# Altium project radxa_c200_io_board_v1.11.PrjPcb (part 8 of 8)

## Sheet 20_KEY_M_X2.SchDoc: C200
size 439 x 311 mm; Page Create Date: March  8, 1995; Page Number: 20; Page Size: Custom; Comment: radxa_1010; Page Count: 21; RevCode: V1.11; Doc: 20_KEY_M_X2; DsnPath: D:\WMS\C200\CC122\对外\C200 V1.11.DSN; SchematicName: c200; PageName: 20_KEY_M_X2; PageSize: Custom; TopSchematic: True
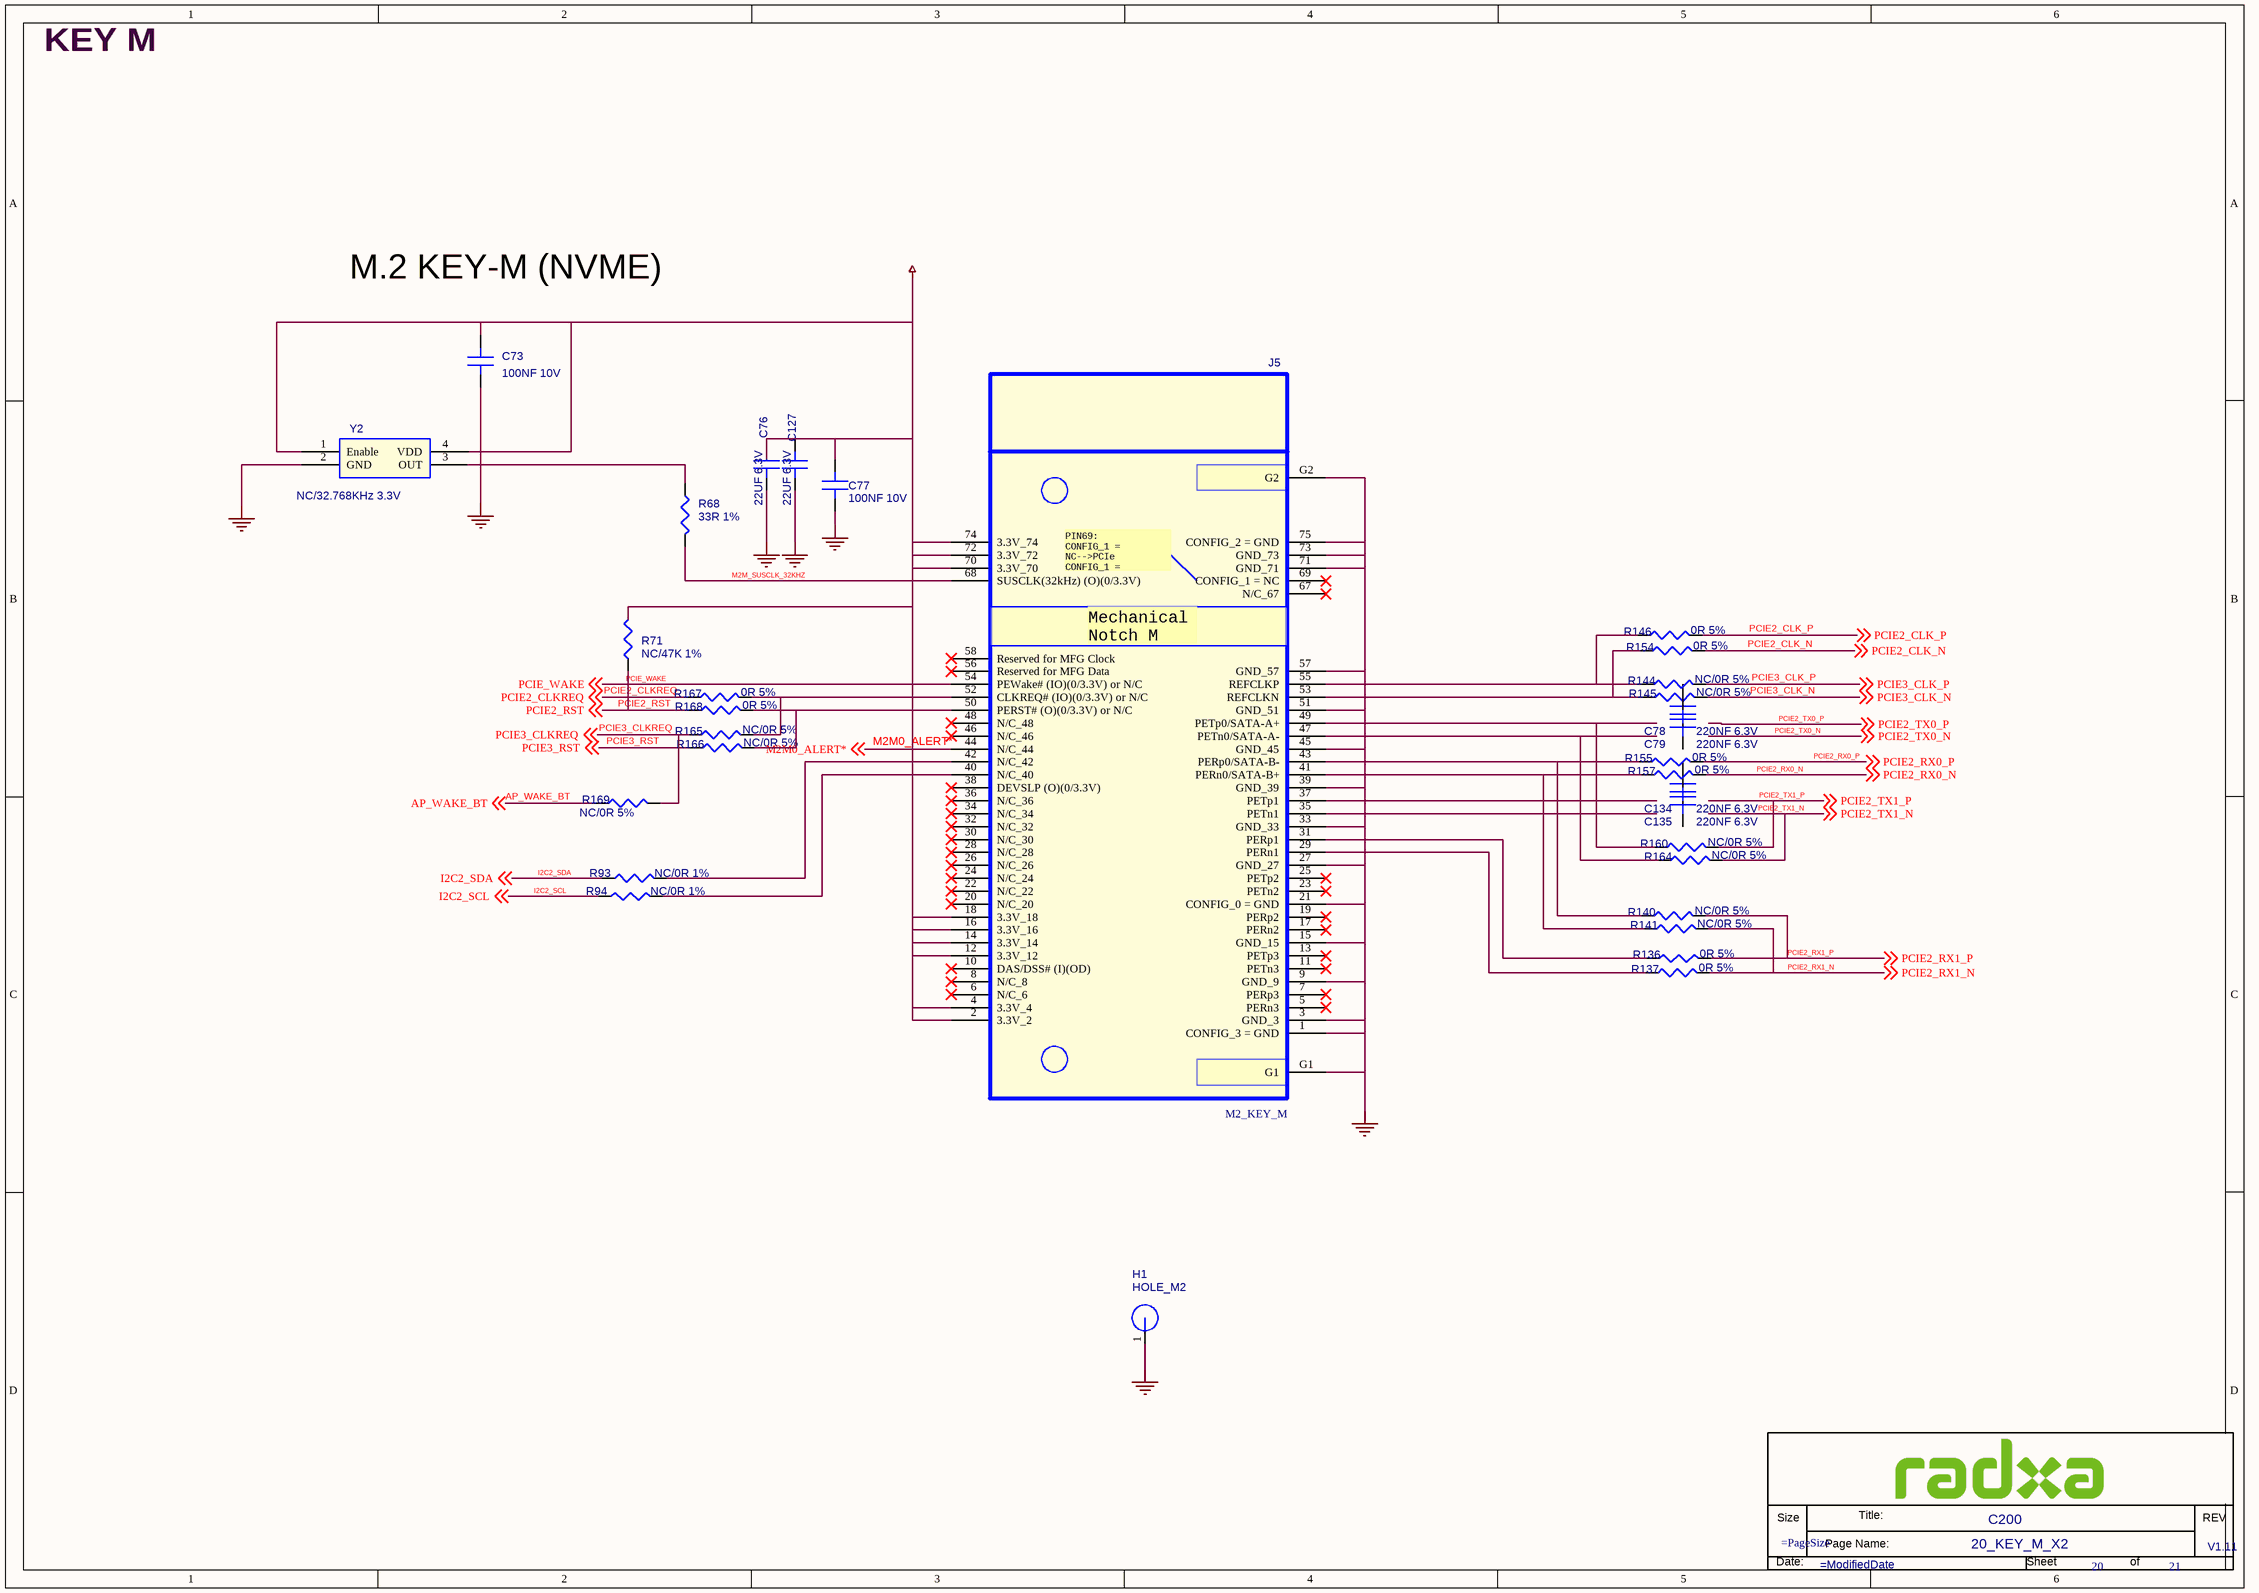
[diagram p39: 20_KEY_M_X2.SchDoc]

### Parts
(Parts that share a designator on the sheet are numbered #1, #2 ... from top to bottom, then left to right.)
*#19  Doc: 20_KEY_M_X2  RevCode: V1.11  Title: C200  Page Number: 20  Page Count: 21  (hidden comment: radxa_1010)  (graphical)
C73  100NF 10V  [C0402]
C76  22UF 6.3V  [C0603]
C77  100NF 10V  [C0402]
C78  220NF 6.3V  [C0201]
C79  220NF 6.3V  [C0201]
C127  22UF 6.3V  [C0603]
C134  220NF 6.3V  [C0201]
C135  220NF 6.3V  [C0201]
H1  HOLE_M2  [H3.8MM]
J5  M2_KEY_M  [M2-M_KEY_SM_75_0D5]
R68  33R 1%  [R0402]
R71  NC/47K 1%  [R0402]
R93  NC/0R 1%  [R0402]
R94  NC/0R 1%  [R0402]
R136  0R 5%  [R0402]
R137  0R 5%  [R0402]
R140  NC/0R 5%  [R0402]
R141  NC/0R 5%  [R0402]
R144  NC/0R 5%  [R0402]
R145  NC/0R 5%  [R0402]
R146  0R 5%  [R0402]
R154  0R 5%  [R0402]
R155  0R 5%  [R0402]
R157  0R 5%  [R0402]
R160  NC/0R 5%  [R0402]
R164  NC/0R 5%  [R0402]
R165  NC/0R 5%  [R0402]
R166  NC/0R 5%  [R0402]
R167  0R 5%  [R0402]
R168  0R 5%  [R0402]
R169  NC/0R 5%  [R0402]
Y2  NC/32.768KHz 3.3V  [Y-4-5_08-TXC-7W5]

### Nets
GND: C73.2(B) C76.2(B) C77.2(B) C127.2(B) H1.1 J5.1(CONFIG_3_=_GND) J5.3(GND_3) J5.9(GND_9) J5.15(GND_15) J5.21(CONFIG_0_=_GND) J5.27(GND_27) J5.33(GND_33) J5.39(GND_39) J5.45(GND_45) J5.51(GND_51) J5.57(GND_57) J5.71(GND_71) J5.73(GND_73) J5.75(CONFIG_2_=_GND) J5.G1 J5.G2 Y2.2(GND)  [project net HUB2_SSTX_N_J25]
MKEY_3V3: C73.1(A) C76.1(A) C77.1(A) C127.1(A) J5.2(3.3V_2) J5.4(3.3V_4) J5.12(3.3V_12) J5.14(3.3V_14) J5.16(3.3V_16) J5.18(3.3V_18) J5.70(3.3V_70) J5.72(3.3V_72) J5.74(3.3V_74) R71.1 Y2.1(Enable) Y2.4(VDD)
AP_WAKE_BT: R169.1 ; off-sheet AP_WAKE_BT
I2C2_SCL: R94.1 ; off-sheet I2C2_SCL
I2C2_SDA: R93.1 ; off-sheet I2C2_SDA
M2M0_ALERT*: J5.44(N/C_44) ; off-sheet M2M0_ALERT*
M2M_SUSCLK_32KHZ: J5.68(SUSCLK(32kHz)_(O)(0/3.3V)) R68.2
PCIE2_CLK_N: R154.2 ; off-sheet PCIE2_CLK_N
PCIE2_CLK_P: R146.2 ; off-sheet PCIE2_CLK_P
PCIE2_CLKREQ: R167.1 ; off-sheet PCIE2_CLKREQ
PCIE2_RST: R71.2 R168.1 ; off-sheet PCIE2_RST
PCIE2_RX0_N: R157.2 ; off-sheet PCIE2_RX0_N
PCIE2_RX0_P: R155.2 ; off-sheet PCIE2_RX0_P
PCIE2_RX1_N: R137.2 R141.2 ; off-sheet PCIE2_RX1_N
PCIE2_RX1_P: R136.2 R140.2 ; off-sheet PCIE2_RX1_P
PCIE2_TX1_N: R164.2 ; off-sheet PCIE2_TX1_N
PCIE2_TX1_P: R160.2 ; off-sheet PCIE2_TX1_P
PCIE3_CLK_N: R145.2 ; off-sheet PCIE3_CLK_N
PCIE3_CLK_P: R144.2 ; off-sheet PCIE3_CLK_P
PCIE3_CLKREQ: R165.1 R169.2 ; off-sheet PCIE3_CLKREQ
PCIE3_RST: R166.1 ; off-sheet PCIE3_RST
PCIE_WAKE: J5.54(PEWake#_(IO)(0/3.3V)_or_N/C) ; off-sheet PCIE_WAKE
NetJ5_29: J5.29(PERn1) R137.1
NetJ5_31: J5.31(PERp1) R136.1
NetJ5_40: J5.40(N/C_40) R94.2
NetJ5_41: J5.41(PERn0/SATA-B+) R141.1 R157.1
NetJ5_42: J5.42(N/C_42) R93.2
NetJ5_43: J5.43(PERp0/SATA-B-) R140.1 R155.1
NetJ5_47: J5.47(PETn0/SATA-A-) R164.1
NetJ5_49: J5.49(PETp0/SATA-A+) R160.1
NetJ5_50: J5.50(PERST#_(O)(0/3.3V)_or_N/C) R166.2 R168.2
NetJ5_52: J5.52(CLKREQ#_(IO)(0/3.3V)_or_N/C) R165.2 R167.2
NetJ5_53: J5.53(REFCLKN) R145.1 R154.1
NetJ5_55: J5.55(REFCLKP) R144.1 R146.1
NetR68_1: R68.1 Y2.3(OUT)

Not connected (* = marked no-connect by the designer): C78 1(A) 2(B); C79 1(A) 2(B); C134 1(A) 2(B); C135 1(A) 2(B); J5 5(PERn3)* 6(N/C_6)* 7(PERp3)* 8(N/C_8)* 10(DAS/DSS#_(I)(OD))* 11(PETn3)* 13(PETp3)* 17(PERn2)* 19(PERp2)* 20(N/C_20)* 22(N/C_22)* 23(PETn2)* 24(N/C_24)* 25(PETp2)* 26(N/C_26)* 28(N/C_28)* 30(N/C_30)* 32(N/C_32)* 34(N/C_34)* 35(PETn1) 36(N/C_36)* 37(PETp1) 38(DEVSLP_(O)(0/3.3V))* 46(N/C_46)* 48(N/C_48)* 56(Reserved_for_MFG_Data)* 58(Reserved_for_MFG_Clock)* 67(N/C_67)* 69(CONFIG_1_=_NC)*

### Notes on the sheet
- KEY M
- M.2 KEY-M (NVME)
- (in symbol M2_KEY_M) PIN69: / CONFIG_1 = NC-->PCIe / CONFIG_1 = / GND-->SATA; Mechanical / Notch M
- (in symbol radxa_1010) Size; Title:; REV; Page Name:; Date:; Sheet; of

### Library data of the parts
C73 = C: SMD  0402  100NF  10V  X5R  ±10%  ROHS; PARTS: 1; Part Reference: C73; Part Number: A1C01.00163; OriginalSymbolOrigin: (0,30); PKG_TYPE: CAP2-100-250; LEVEL: STD; PINSWAP: (A,B); Value: 100NF 10V; Part Type: 陶瓷电容; PCB Footprint: C0402
C76 = C: SMD  0603  22UF  6.3V  X5R  ±20%  ROHS; PARTS: 1; Part Reference: C76; Part Number: A1C01.00004; OriginalSymbolOrigin: (0,30); PKG_TYPE: CAP2-100-250; LEVEL: STD; PINSWAP: (A,B); Value: 22UF 6.3V; Part Type: 陶瓷电容; PCB Footprint: C0603
C77 = C: SMD  0402  100NF  10V  X5R  ±10%  ROHS; PARTS: 1; Part Reference: C77; Part Number: A1C01.00163; OriginalSymbolOrigin: (0,30); PKG_TYPE: CAP2-100-250; LEVEL: STD; PINSWAP: (A,B); Value: 100NF 10V; Part Type: 陶瓷电容; PCB Footprint: C0402
C78 = C: SMD  0201  220NF  6.3V  X5R  ±20%  ROHS; PARTS: 1; Part Reference: C78; CDS_PART_NAME: C_0402-0.22UF,X5R,10%,6.3V,039-0011-000; CDS_PHYS_PART_NAME: C_0402-0.22UF,X5R,10%,6.3V,039-0011-000-0.22UF,039-0011-000; Part Number: A1C01.00128; OriginalSymbolOrigin: (0,30); PKG_TYPE: CAP2-100-250; LEVEL: STD; PINSWAP: (A,B); ASSEMBLY: M2_NVME; CDS_LIB: discrete; DEVICE_TYPENAME: C_0402-022UFX5R1063V039-0011-000-022UF039-0011-000; DRAWING: #NAME?; NV_PN: 039-0011-000; PACK_TYPE: 402; PATH: I24; PHYS_PAGE: 21; ROT: 0; SIGNAL_MODEL: nv_cap; TOL: 10%; VER: 2; XY: (-3150,4300); Value: 220NF 6.3V; CDS_SEC: 1; CHIPS_PART_NAME: C; MAT: X5R; MAX_VOLTAGE: 6.3V; SEC: 1; Part Type: 陶瓷电容; PCB Footprint: C0201
C79 = C: SMD  0201  220NF  6.3V  X5R  ±20%  ROHS; PARTS: 1; Part Reference: C79; CDS_PART_NAME: C_0402-0.22UF,X5R,10%,6.3V,039-0011-000; CDS_PHYS_PART_NAME: C_0402-0.22UF,X5R,10%,6.3V,039-0011-000-0.22UF,039-0011-000; Part Number: A1C01.00128; OriginalSymbolOrigin: (0,30); PKG_TYPE: CAP2-100-250; LEVEL: STD; PINSWAP: (A,B); ASSEMBLY: M2_NVME; CDS_LIB: discrete; DEVICE_TYPENAME: C_0402-022UFX5R1063V039-0011-000-022UF039-0011-000; DRAWING: #NAME?; NV_PN: 039-0011-000; PACK_TYPE: 402; PATH: I8; PHYS_PAGE: 21; ROT: 0; SIGNAL_MODEL: nv_cap; TOL: 10%; VER: 2; XY: (-2700,4250); Value: 220NF 6.3V; CDS_SEC: 1; CHIPS_PART_NAME: C; MAT: X5R; MAX_VOLTAGE: 6.3V; SEC: 1; Part Type: 陶瓷电容; PCB Footprint: C0201
C127 = C: SMD  0603  22UF  6.3V  X5R  ±20%  ROHS; PARTS: 1; Part Reference: C127; Part Number: A1C01.00004; OriginalSymbolOrigin: (0,30); PKG_TYPE: CAP2-100-250; LEVEL: STD; PINSWAP: (A,B); Value: 22UF 6.3V; Part Type: 陶瓷电容; PCB Footprint: C0603
C134 = C: SMD  0201  220NF  6.3V  X5R  ±20%  ROHS; PARTS: 1; Part Reference: C134; CDS_PART_NAME: C_0402-0.22UF,X5R,10%,6.3V,039-0011-000; CDS_PHYS_PART_NAME: C_0402-0.22UF,X5R,10%,6.3V,039-0011-000-0.22UF,039-0011-000; Part Number: A1C01.00128; OriginalSymbolOrigin: (0,30); PKG_TYPE: CAP2-100-250; LEVEL: STD; PINSWAP: (A,B); ASSEMBLY: M2_NVME; CDS_LIB: discrete; DEVICE_TYPENAME: C_0402-022UFX5R1063V039-0011-000-022UF039-0011-000; DRAWING: #NAME?; NV_PN: 039-0011-000; PACK_TYPE: 402; PATH: I32; PHYS_PAGE: 21; ROT: 0; SIGNAL_MODEL: nv_cap; TOL: 10%; VER: 2; XY: (-3150,4000); Value: 220NF 6.3V; CDS_SEC: 1; CHIPS_PART_NAME: C; MAT: X5R; MAX_VOLTAGE: 6.3V; SEC: 1; Part Type: 陶瓷电容; PCB Footprint: C0201
C135 = C: SMD  0201  220NF  6.3V  X5R  ±20%  ROHS; PARTS: 1; Part Reference: C135; CDS_PART_NAME: C_0402-0.22UF,X5R,10%,6.3V,039-0011-000; CDS_PHYS_PART_NAME: C_0402-0.22UF,X5R,10%,6.3V,039-0011-000-0.22UF,039-0011-000; Part Number: A1C01.00128; OriginalSymbolOrigin: (0,30); PKG_TYPE: CAP2-100-250; LEVEL: STD; PINSWAP: (A,B); ASSEMBLY: M2_NVME; CDS_LIB: discrete; DEVICE_TYPENAME: C_0402-022UFX5R1063V039-0011-000-022UF039-0011-000; DRAWING: #NAME?; NV_PN: 039-0011-000; PACK_TYPE: 402; PATH: I21; PHYS_PAGE: 21; ROT: 0; SIGNAL_MODEL: nv_cap; TOL: 10%; VER: 2; XY: (-2700,3950); Value: 220NF 6.3V; CDS_SEC: 1; CHIPS_PART_NAME: C; MAT: X5R; MAX_VOLTAGE: 6.3V; SEC: 1; Part Type: 陶瓷电容; PCB Footprint: C0201
H1 = HOLE: Part Reference: H1; PCB Footprint: HOLE_2D7_6D0_A; RK PN: HOLE_3R50; Priority: A; Value: HOLE_M2; Part Type: HOLE
J5 = M2_KEY_M: SMD  母座  75PIN  180度  M.2  M KEY  H4.2  0.5mm脚距  APC10359-P001A  黑色  LOTES  ROHS; Part Reference: J5; Part Number: A1J01.00017; Parameter: 连接器-比派-封装 M2_KEY_M; Value: M2_KEY_M; Part Type: 连接座; PCB Footprint: M2-M_KEY_SM_75_0D5
R68 = R: SMD  0201  33R  1/20W  ±1%  ROHS; Part Reference: R68; Part Number: A1R01.00137; PCB Footprint: R0201; Value: 33R 1%; Part Type: 贴片电阻
R71 = R: SMD  0402  47K  1/16W  ±1%  ROHS; Part Reference: R71; Part Number: A1R01.00248; CDS_PART_NAME: R_0402-47K,5 %,62.5MW,195-0599-000; CDS_PHYS_PART_NAME: R_0402-47K,5 %,62.5MW,195-0599-000-195-0599-000,47K; ASSEMBLY: M2_NVME; CDS_LIB: discrete; CDS_SEC: 1; DEVICE_TYPENAME: R_0402-47K5625MW195-0599-000-195-0599-00047K; DRAWING: #NAME?; MAX_WATTAGE: 62.5mW; NV_PN: 195-0599-000; PACK_TYPE: 402; PATH: I39; PHYS_PAGE: 21; ROT: 2; SIGNAL_MODEL: nv_res; TOL: 5%; XY: (-8000,4600); PCB Footprint: R0402; Value: NC/47K 1%; Part Type: 贴片电阻; CHIPS_PART_NAME: R; SKU: NO STUFF; VER: 2; SEC: 1
R93 = R: SMD  0402  0R  1/16W  ±1%  ROHS; Part Reference: R93; Part Number: A1R01.00219; PCB Footprint: R0402; Value: NC/0R 1%; Part Type: 贴片电阻
R94 = R: SMD  0402  0R  1/16W  ±1%  ROHS; Part Reference: R94; Part Number: A1R01.00219; PCB Footprint: R0402; Value: NC/0R 1%; Part Type: 贴片电阻
R136 = R: SMD  0201  0R  1/20W  ±5%  ROHS; Part Reference: R136; Part Number: A1R01.00027; PCB Footprint: R0201; Temp Coeff: －55℃ ~ ＋125℃; Value: 0R 5%; Part Type: 贴片电阻
R137 = R: SMD  0201  0R  1/20W  ±5%  ROHS; Part Reference: R137; Part Number: A1R01.00027; PCB Footprint: R0201; Temp Coeff: －55℃ ~ ＋125℃; Value: 0R 5%; Part Type: 贴片电阻
R140 = R: SMD  0201  0R  1/20W  ±5%  ROHS; Part Reference: R140; Part Number: A1R01.00027; PCB Footprint: R0201; Temp Coeff: －55℃ ~ ＋125℃; Value: NC/0R 5%; Part Type: 贴片电阻
R141 = R: SMD  0201  0R  1/20W  ±5%  ROHS; Part Reference: R141; Part Number: A1R01.00027; PCB Footprint: R0201; Temp Coeff: －55℃ ~ ＋125℃; Value: NC/0R 5%; Part Type: 贴片电阻
R144 = R: SMD  0201  0R  1/20W  ±5%  ROHS; Part Reference: R144; Part Number: A1R01.00027; PCB Footprint: R0201; Temp Coeff: －55℃ ~ ＋125℃; Value: NC/0R 5%; Part Type: 贴片电阻
R145 = R: SMD  0201  0R  1/20W  ±5%  ROHS; Part Reference: R145; Part Number: A1R01.00027; PCB Footprint: R0201; Temp Coeff: －55℃ ~ ＋125℃; Value: NC/0R 5%; Part Type: 贴片电阻
R146 = R: SMD  0201  0R  1/20W  ±5%  ROHS; Part Reference: R146; Part Number: A1R01.00027; PCB Footprint: R0201; Temp Coeff: －55℃ ~ ＋125℃; Value: 0R 5%; Part Type: 贴片电阻
R154 = R: SMD  0201  0R  1/20W  ±5%  ROHS; Part Reference: R154; Part Number: A1R01.00027; PCB Footprint: R0201; Temp Coeff: －55℃ ~ ＋125℃; Value: 0R 5%; Part Type: 贴片电阻
R155 = R: SMD  0201  0R  1/20W  ±5%  ROHS; Part Reference: R155; Part Number: A1R01.00027; PCB Footprint: R0201; Temp Coeff: －55℃ ~ ＋125℃; Value: 0R 5%; Part Type: 贴片电阻
R157 = R: SMD  0201  0R  1/20W  ±5%  ROHS; Part Reference: R157; Part Number: A1R01.00027; PCB Footprint: R0201; Temp Coeff: －55℃ ~ ＋125℃; Value: 0R 5%; Part Type: 贴片电阻
R160 = R: SMD  0201  0R  1/20W  ±5%  ROHS; Part Reference: R160; Part Number: A1R01.00027; PCB Footprint: R0201; Temp Coeff: －55℃ ~ ＋125℃; Value: NC/0R 5%; Part Type: 贴片电阻
R164 = R: SMD  0201  0R  1/20W  ±5%  ROHS; Part Reference: R164; Part Number: A1R01.00027; PCB Footprint: R0201; Temp Coeff: －55℃ ~ ＋125℃; Value: NC/0R 5%; Part Type: 贴片电阻
R165 = R: SMD  0201  0R  1/20W  ±5%  ROHS; Part Reference: R165; Part Number: A1R01.00027; PCB Footprint: R0201; Temp Coeff: －55℃ ~ ＋125℃; Value: NC/0R 5%; Part Type: 贴片电阻
R166 = R: SMD  0201  0R  1/20W  ±5%  ROHS; Part Reference: R166; Part Number: A1R01.00027; PCB Footprint: R0201; Temp Coeff: －55℃ ~ ＋125℃; Value: NC/0R 5%; Part Type: 贴片电阻
R167 = R: SMD  0201  0R  1/20W  ±5%  ROHS; Part Reference: R167; Part Number: A1R01.00027; PCB Footprint: R0201; Temp Coeff: －55℃ ~ ＋125℃; Value: 0R 5%; Part Type: 贴片电阻
R168 = R: SMD  0201  0R  1/20W  ±5%  ROHS; Part Reference: R168; Part Number: A1R01.00027; PCB Footprint: R0201; Temp Coeff: －55℃ ~ ＋125℃; Value: 0R 5%; Part Type: 贴片电阻
R169 = R: SMD  0201  0R  1/20W  ±5%  ROHS; Part Reference: R169; Part Number: A1R01.00027; PCB Footprint: R0201; Temp Coeff: －55℃ ~ ＋125℃; Value: NC/0R 5%; Part Type: 贴片电阻
Y2 = OSC_4P_V: SMD  编带  有源  3225  32.768KHz  3.3V  ±10ppm  ROHS; Part Reference: Y2; Part Number: A1Y01.00030; PCB Footprint: OSC_SM4_3D2X2D5; Value: NC/32.768KHz 3.3V; Part Type: 晶振
*#19 = radxa_1010: Page Create Date: March  8, 1995; Page Size: =PageSize; Page Modify Date: =ModifiedDate

## Sheet 21_KEY_E.SchDoc: C200
size 439 x 311 mm; Page Create Date: March  8, 1995; Page Number: 21; Page Size: Custom; Comment: radxa_1010; Page Count: 21; RevCode: V1.11; Doc: 21_KEY_E; DsnPath: D:\WMS\C200\CC122\对外\C200 V1.11.DSN; SchematicName: c200; PageName: 21_KEY_E; PageSize: Custom; TopSchematic: True
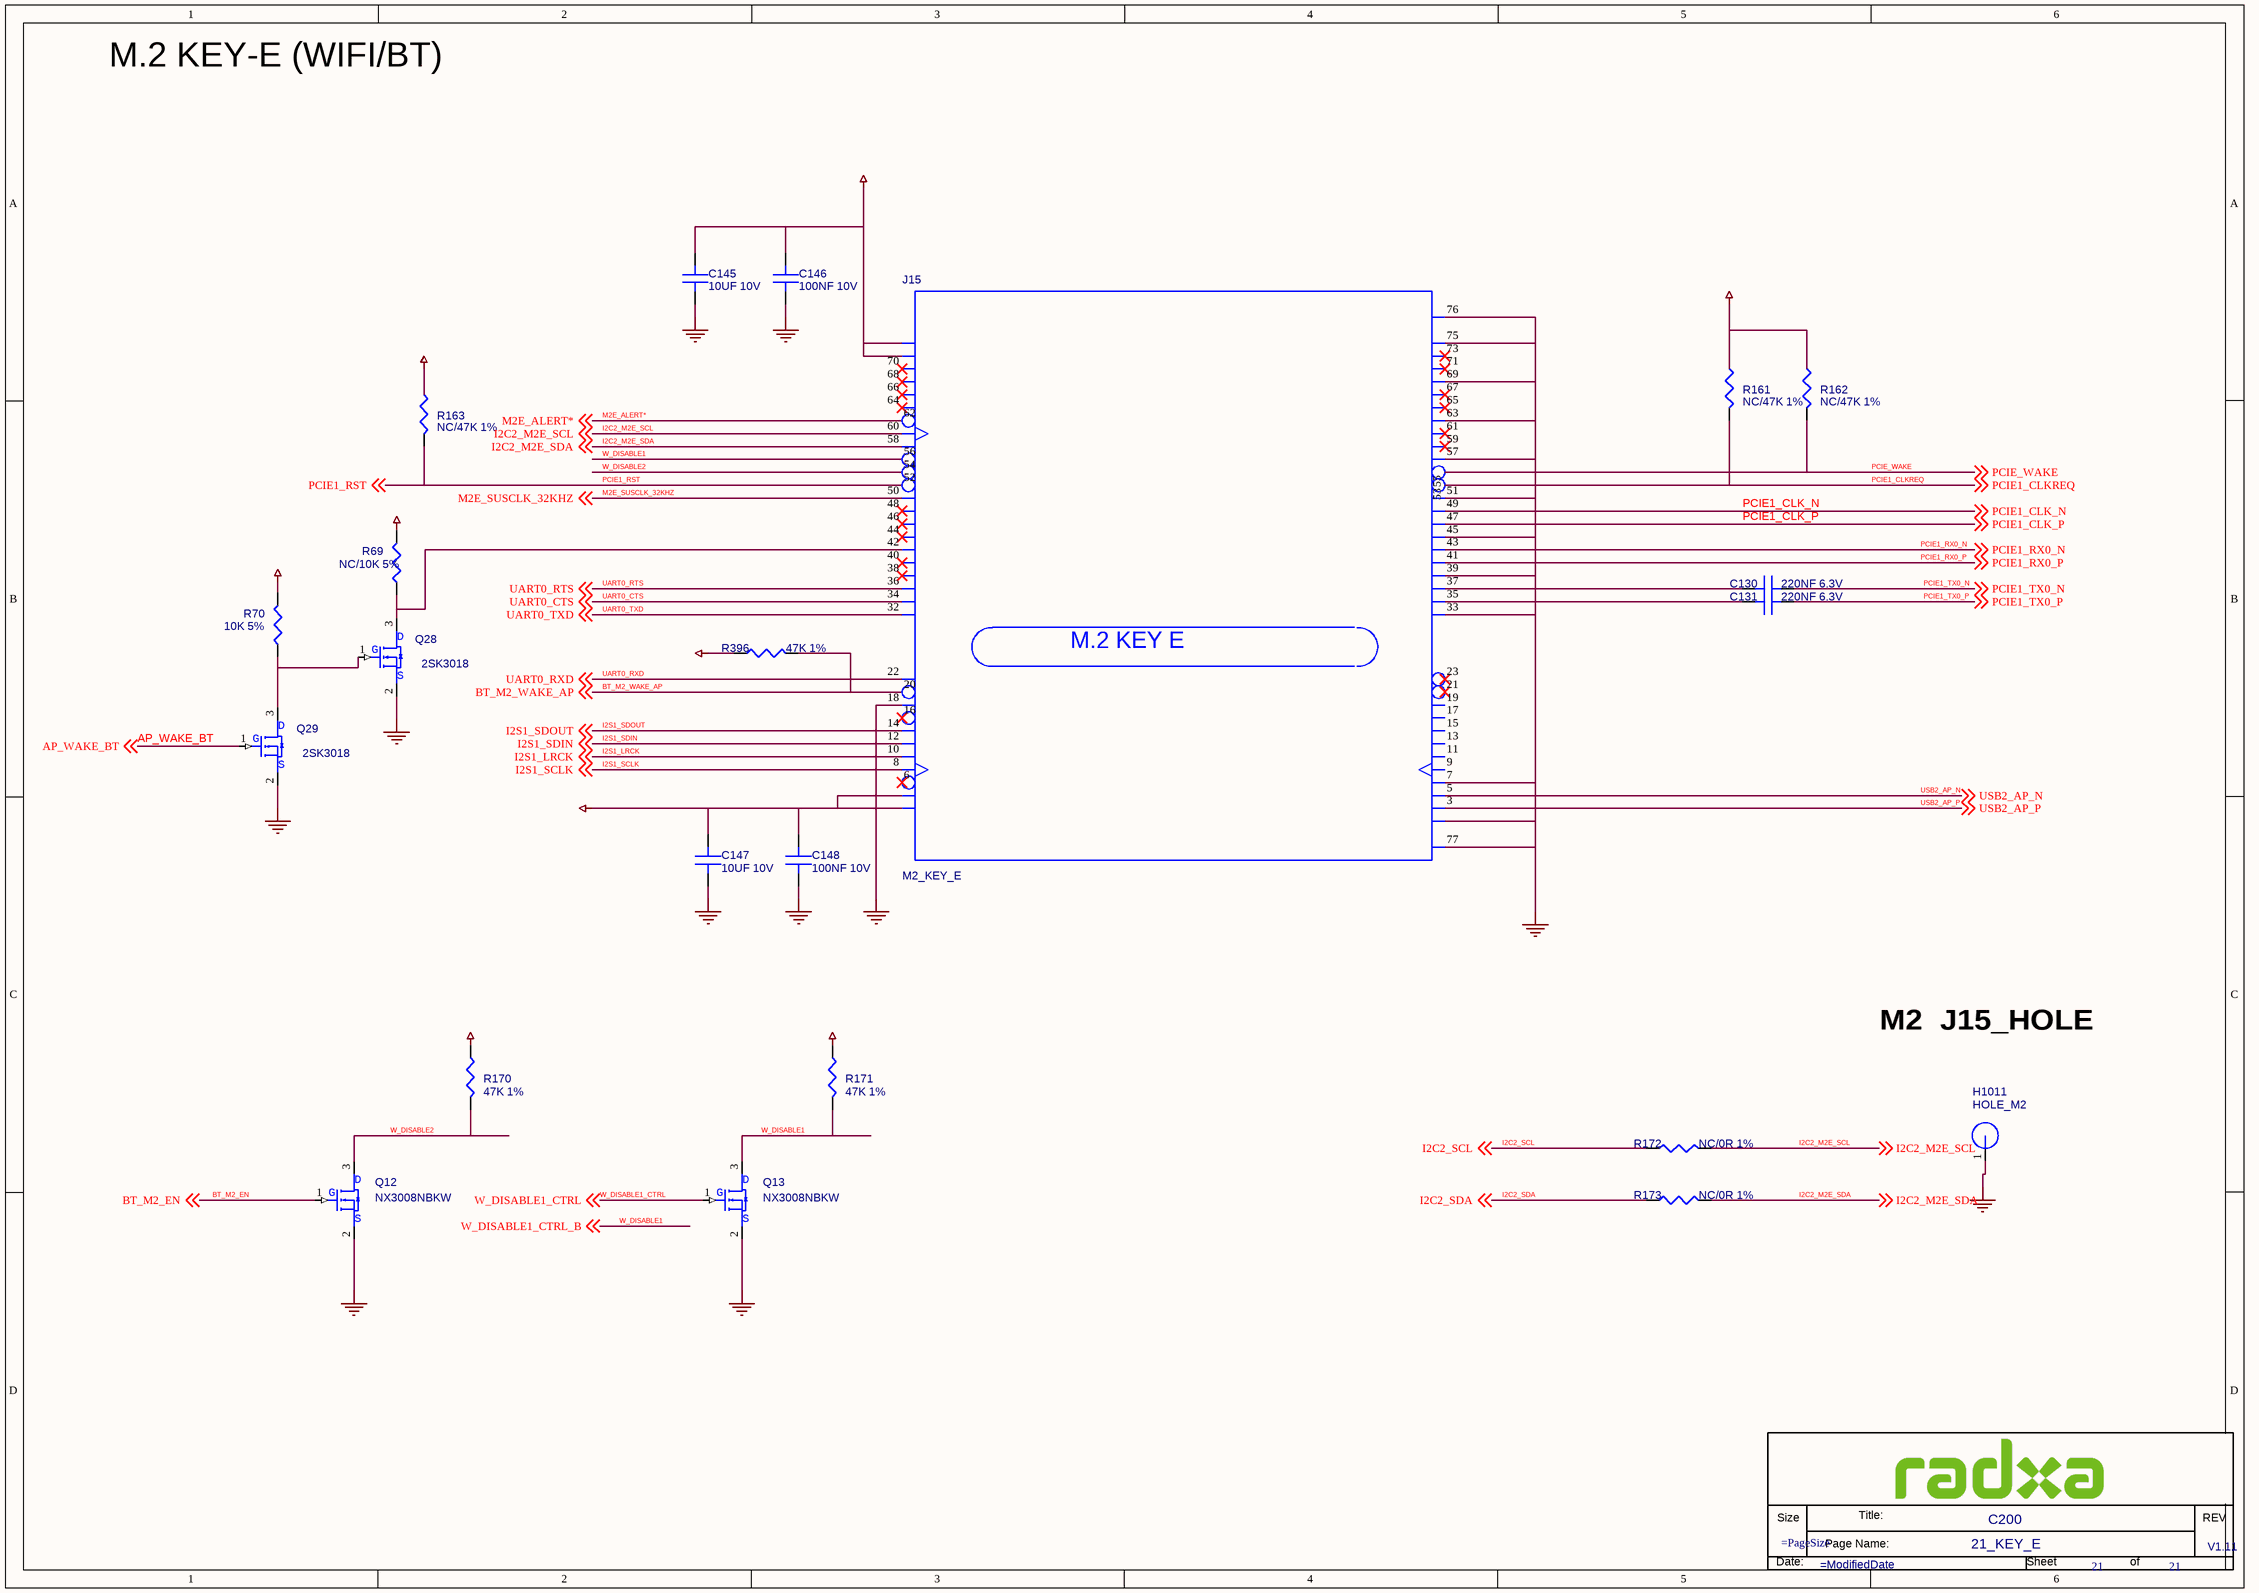
[diagram p40: 21_KEY_E.SchDoc]

### Parts
(Parts that share a designator on the sheet are numbered #1, #2 ... from top to bottom, then left to right.)
*#20  Doc: 21_KEY_E  RevCode: V1.11  Title: C200  Page Number: 21  (hidden comment: radxa_1010)  (graphical)
C130  220NF 6.3V  [C0201]
C131  220NF 6.3V  [C0201]
C145  10UF 10V  [C0603]
C146  100NF 10V  [C0402]
C147  10UF 10V  [C0603]
C148  100NF 10V  [C0402]
H1011  HOLE_M2  [H3.8MM]
J15  M2_KEY_E  [PCIE_E_KEY_SM75_0D5_30]
Q12  NX3008NBKW  [SOT_323]
Q13  NX3008NBKW  [SOT_323]
Q28  2SK3018  [SOT_323]
Q29  2SK3018  [SOT_323]
R69  NC/10K 5%  [R0402]
R70  10K 5%  [R0402]
R161  NC/47K 1%  [R0402]
R162  NC/47K 1%  [R0402]
R163  NC/47K 1%  [R0402]
R170  47K 1%  [R0402]
R171  47K 1%  [R0402]
R172  NC/0R 1%  [R0402]
R173  NC/0R 1%  [R0402]
R396  47K 1%  [R0402]

### Nets
3P3V_1: J15.74(3P3V_1)
3P3V_2: J15.72(3P3V_2)
3P3V_3: J15.4(3P3V_3)
3P3V_4: J15.2(3P3V_4)
GND: C145.2(B) C146.2(B) C147.2(B) C148.2(B) H1011.1 J15.7(GND_10) J15.18(GND_9) J15.33(GND_8) J15.39(GND_7) J15.45(GND_6) J15.51(GND_5) J15.57(GND_4) J15.63(GND_3) J15.69(GND_2) J15.75(GND_1) J15.76(GND_13) J15.77(GND_12) Q12.2(S) Q13.2(S) Q28.2(S) Q29.2(S)  [project net HUB2_SSTX_N_J25]
GND_11: J15.1(GND_11)
VDD_1V8: R69.1 R70.1
VDD_3V3_SYS: C145.1(A) C146.1(A) C147.1(A) C148.1(A) R161.1 R162.1 R163.1 R170.1 R171.1 R396.1  [project net 3V3]
AP_WAKE_BT: Q29.1(G) ; off-sheet AP_WAKE_BT
BT_M2_EN: Q12.1(G) ; off-sheet BT_M2_EN
BT_M2_WAKE_AP: J15.20(UART_WAKE*) R396.2 ; off-sheet BT_M2_WAKE_AP
I2C2_M2E_SCL: J15.60(I2C_CLK) R172.2 ; off-sheet I2C2_M2E_SCL
I2C2_M2E_SDA: J15.58(I2C_DATA) R173.2 ; off-sheet I2C2_M2E_SDA
I2C2_SCL: R172.1 ; off-sheet I2C2_SCL
I2C2_SDA: R173.1 ; off-sheet I2C2_SDA
I2S1_LRCK: J15.10(PCM_SYNC_125_WS) ; off-sheet I2S1_LRCK
I2S1_SCLK: J15.8(PCM_CLK_12S_SCK) ; off-sheet I2S1_SCLK
I2S1_SDIN: J15.12(PCM_IN_12S_SD_IN) ; off-sheet I2S1_SDIN
I2S1_SDOUT: J15.14(PCM_OUT_12S_SD_OUT) ; off-sheet I2S1_SDOUT
M2E_ALERT*: J15.62(ALERT*) ; off-sheet M2E_ALERT*
M2E_SUSCLK_32KHZ: J15.50(SUSCLK_32KHZ) ; off-sheet M2E_SUSCLK_32KHZ
PCIE1_CLK_N: J15.49(REFCLKNO) ; off-sheet PCIE1_CLK_N
PCIE1_CLK_P: J15.47(REFCLKPO) ; off-sheet PCIE1_CLK_P
PCIE1_CLKREQ: J15.53(CLKREQO*) R161.2 ; off-sheet PCIE1_CLKREQ
PCIE1_RST: J15.52(PERST0*) R163.2 ; off-sheet PCIE1_RST
PCIE1_RX0_N: J15.43(PERNO) ; off-sheet PCIE1_RX0_N
PCIE1_RX0_P: J15.41(PERPO) ; off-sheet PCIE1_RX0_P
PCIE1_TX0_N: C130.2(B) ; off-sheet PCIE1_TX0_N
PCIE1_TX0_P: C131.2(B) ; off-sheet PCIE1_TX0_P
PCIE_WAKE: J15.55(PEWAKEO*) R162.2 ; off-sheet PCIE_WAKE
UART0_CTS: J15.34(UART_CTS) ; off-sheet UART0_CTS
UART0_RTS: J15.36(UART_RTS) ; off-sheet UART0_RTS
UART0_RXD: J15.22(UART_RXD) ; off-sheet UART0_RXD
UART0_TXD: J15.32(UART_TXD) ; off-sheet UART0_TXD
USB2_AP_N: J15.5(USB_DM) ; off-sheet USB2_AP_N
USB2_AP_P: J15.3(USB_DP) ; off-sheet USB2_AP_P
W_DISABLE1: J15.56(W_DISABLE1*) Q13.3(D) R171.2 ; off-sheet W_DISABLE1_CTRL_B  [also labelled W_DISABLE1_CTRL_B]
W_DISABLE1_CTRL: Q13.1(G) ; off-sheet W_DISABLE1_CTRL
W_DISABLE2: J15.54(W_DISABLE2*) Q12.3(D) R170.2
NetC130_1: C130.1(A) J15.37(PETNO)
NetC131_1: C131.1(A) J15.35(PETPO)
NetJ15_42: J15.42(VENDOR_DEFINED_1) Q28.3(D) R69.2
NetQ28_1: Q28.1(G) Q29.3(D) R70.2

Not connected (* = marked no-connect by the designer): J15 6(LED1*)* 9(SDIO_CLK) 11(SDIO_CMD) 13(SDIO_DATAO) 15(SDIO_DATA1) 16(LED2*)* 17(SDIO_DATA2) 19(SDIO_DATA3) 21(SDIO_WAKE*)* 23(SDIO_RESET*)* 38(VENDOR_DEFINED_3)* 40(VENDOR_DEFINED_2)* 44(COEX3)* 46(COEX2)* 48(COEX1)* 59(RESERVED_PETP1)* 61(RESERVED_PETN1)* 64(RESERVED)* 65(RESERVED_PERP1)* 66(UIM_SWP_PERST1*)* 67(RESERVED_PERN1)* 68(UIM_POWER_SNK_CLKREQ1*)* 70(UIM_POWER_SRC_GPIO1_PEWAKE1*)* 71(RESERVED_REFCLKP1)* 73(RESERVED_REFCLKN1)*

### Notes on the sheet
- M.2 KEY-E (WIFI/BT)
- M2  J15_HOLE
- (in symbol M2_KEY_E) M.2 KEY E
- (in symbol radxa_1010) Size; Title:; REV; Page Name:; Date:; Sheet; of

### Library data of the parts
C130 = C: SMD  0201  220NF  6.3V  X5R  ±20%  ROHS; PARTS: 1; Part Reference: C130; Part Number: A1C01.00128; OriginalSymbolOrigin: (0,30); PKG_TYPE: CAP2-100-250; LEVEL: STD; PINSWAP: (A,B); Value: 220NF 6.3V; Part Type: 陶瓷电容; PCB Footprint: C0201
C131 = C: SMD  0201  220NF  6.3V  X5R  ±20%  ROHS; PARTS: 1; Part Reference: C131; Part Number: A1C01.00128; OriginalSymbolOrigin: (0,30); PKG_TYPE: CAP2-100-250; LEVEL: STD; PINSWAP: (A,B); Value: 220NF 6.3V; Part Type: 陶瓷电容; PCB Footprint: C0201
C145 = C: SMD  0603  10UF  10V  X5R  ±10%  ROHS; PARTS: 1; Part Reference: C145; Part Number: A1C01.00270; OriginalSymbolOrigin: (0,30); PKG_TYPE: CAP2-100-250; LEVEL: STD; PINSWAP: (A,B); Value: 10UF 10V; Part Type: 陶瓷电容; PCB Footprint: C0603
C146 = C: SMD  0402  100NF  10V  X5R  ±10%  ROHS; PARTS: 1; Part Reference: C146; Part Number: A1C01.00163; OriginalSymbolOrigin: (0,30); PKG_TYPE: CAP2-100-250; LEVEL: STD; PINSWAP: (A,B); Value: 100NF 10V; Part Type: 陶瓷电容; PCB Footprint: C0402
C147 = C: SMD  0603  10UF  10V  X5R  ±10%  ROHS; PARTS: 1; Part Reference: C147; Part Number: A1C01.00270; OriginalSymbolOrigin: (0,30); PKG_TYPE: CAP2-100-250; LEVEL: STD; PINSWAP: (A,B); Value: 10UF 10V; Part Type: 陶瓷电容; PCB Footprint: C0603
C148 = C: SMD  0402  100NF  10V  X5R  ±10%  ROHS; PARTS: 1; Part Reference: C148; Part Number: A1C01.00163; OriginalSymbolOrigin: (0,30); PKG_TYPE: CAP2-100-250; LEVEL: STD; PINSWAP: (A,B); Value: 100NF 10V; Part Type: 陶瓷电容; PCB Footprint: C0402
H1011 = HOLE: Part Reference: H1011; PCB Footprint: HOLE_2D7_6D0_A; RK PN: HOLE_3R50; Priority: A; Value: HOLE_M2; Part Type: HOLE
J15 = M2_KEY_E: SMD  母座  75PIN  180度  M.2  E  KEY  H4.2mm  0.5mm脚距  APCI0108-P001A  黑色  LOTES  ROHS; Part Reference: J15; Part Number: A1J01.00042; OriginalSymbolOrigin: (-1050,1100); ANGLE: ?; ASSEMBLY: ?; EMI_GROUND_TAB: ?; GENDER: ?; LATCHING: ?; MAX_CURRENT: ?; MAX_VOLTAGE: ?; NV_NAME: ?; NV_PN: ?; PACK_TYPE: ?; PATH: ?; PITCH: ?; PLACEMENT_NOTE: ?; REFLOW: ?; SHIELDED: ?; SHROUDED: ?; SKU: COMMON; Value: M2_KEY_E; Part Type: 连接座; PCB Footprint: PCIE_E_KEY_SM75_0D5_30
Q12 = MOSFET_NPN: SMD  编带  SOT-323  NX3008NBKW  N沟道  Nexperia(安世)  ROHS; Part Reference: Q12; Part Number: A1D01.00070; Temp Coeff: -55℃ to ＋150℃; Value: NX3008NBKW; Part Type: 三极管-MOS管; PCB Footprint: SOT_323
Q13 = MOSFET_NPN: SMD  编带  SOT-323  NX3008NBKW  N沟道  Nexperia(安世)  ROHS; Part Reference: Q13; Part Number: A1D01.00070; Temp Coeff: -55℃ to ＋150℃; Value: NX3008NBKW; Part Type: 三极管-MOS管; PCB Footprint: SOT_323
Q28 = MOSFET_NPN: SMD  编带  SOT-323  2SK3018  N沟道  长晶  ROHS; Part Reference: Q28; Part Number: A1D01.00007; Temp Coeff: -55℃ to ＋150℃; Value: 2SK3018; Part Type: 三极管-MOS管; PCB Footprint: SOT_323
Q29 = MOSFET_NPN: SMD  编带  SOT-323  2SK3018  N沟道  长晶  ROHS; Part Reference: Q29; Part Number: A1D01.00007; Temp Coeff: -55℃ to ＋150℃; Value: 2SK3018; Part Type: 三极管-MOS管; PCB Footprint: SOT_323
R69 = R: SMD  0201  10K  1/20W  ±5%  ROHS; Part Reference: R69; Part Number: A1R01.00012; PCB Footprint: R0201; Temp Coeff: －55℃ ~ ＋125℃; Value: NC/10K 5%; Part Type: 贴片电阻
R70 = R: SMD  0201  10K  1/20W  ±5%  ROHS; Part Reference: R70; Part Number: A1R01.00012; PCB Footprint: R0201; Temp Coeff: －55℃ ~ ＋125℃; Value: 10K 5%; Part Type: 贴片电阻
R161 = R: SMD  0402  47K  1/16W  ±1%  ROHS; Part Reference: R161; CDS_PART_NAME: R_0402-47K,5 %,62.5MW,195-0599-000; CDS_PHYS_PART_NAME: R_0402-47K,5 %,62.5MW,195-0599-000-195-0599-000,47K; Part Number: A1R01.00248; ASSEMBLY: M2_WIFIBT; CDS_LIB: discrete; CDS_SEC: 1; DEVICE_TYPENAME: R_0402-47K5625MW195-0599-000-195-0599-00047K; DRAWING: #NAME?; MAX_WATTAGE: 62.5mW; NV_PN: 195-0599-000; PACK_TYPE: 402; PATH: I15; PHYS_PAGE: 20; ROT: 0; SIGNAL_MODEL: nv_res; TOL: 5%; VER: 2; XY: (-3650,5800); PCB Footprint: R0402; Value: NC/47K 1%; CHIPS_PART_NAME: R; SKU: DNI; SEC: 1; Part Type: 贴片电阻
R162 = R: SMD  0402  47K  1/16W  ±1%  ROHS; Part Reference: R162; CDS_PART_NAME: R_0402-47K,5 %,62.5MW,195-0599-000; CDS_PHYS_PART_NAME: R_0402-47K,5 %,62.5MW,195-0599-000-195-0599-000,47K; Part Number: A1R01.00248; ASSEMBLY: M2_WIFIBT; CDS_LIB: discrete; CDS_SEC: 1; DEVICE_TYPENAME: R_0402-47K5625MW195-0599-000-195-0599-00047K; DRAWING: #NAME?; MAX_WATTAGE: 62.5mW; NV_PN: 195-0599-000; PACK_TYPE: 402; PATH: I14; PHYS_PAGE: 20; ROT: 0; SIGNAL_MODEL: nv_res; TOL: 5%; VER: 2; XY: (-3350,5800); PCB Footprint: R0402; Value: NC/47K 1%; CHIPS_PART_NAME: R; SKU: DNI; SEC: 1; Part Type: 贴片电阻
R163 = R: SMD  0402  47K  1/16W  ±1%  ROHS; Part Reference: R163; Part Number: A1R01.00248; CDS_PHYS_PART_NAME: R_0402-47K,5 %,62.5MW,195-0599-000-195-0599-000,47K; CDS_PART_NAME: R_0402-47K,5 %,62.5MW,195-0599-000; SEC: 1; XY: (-9350,5700); VER: 2; TOL: 5%; SIGNAL_MODEL: nv_res; ROT: 0; PHYS_PAGE: 20; PATH: I52; PACK_TYPE: 402; NV_PN: 195-0599-000; MAX_WATTAGE: 62.5mW; DRAWING: #NAME?; DEVICE_TYPENAME: R_0402-47K5625MW195-0599-000-195-0599-00047K; CDS_LIB: discrete; ASSEMBLY: M2_WIFIBT; PCB Footprint: R0402; Value: NC/47K 1%; Part Type: 贴片电阻; SKU: DNI; CHIPS_PART_NAME: R; CDS_SEC: 1
R170 = R: SMD  0402  47K  1/16W  ±1%  ROHS; Part Reference: R170; Part Number: A1R01.00248; CDS_PHYS_PART_NAME: R_0402-47K,5 %,62.5MW,195-0599-000-195-0599-000,47K; CDS_PART_NAME: R_0402-47K,5 %,62.5MW,195-0599-000; SEC: 1; XY: (-9600,2950); VER: 2; TOL: 5%; SIGNAL_MODEL: nv_res; ROT: 0; PHYS_PAGE: 20; PATH: I72; PACK_TYPE: 402; NV_PN: 195-0599-000; MAX_WATTAGE: 62.5mW; DRAWING: #NAME?; DEVICE_TYPENAME: R_0402-47K5625MW195-0599-000-195-0599-00047K; CDS_LIB: discrete; ASSEMBLY: M2_WIFIBT; PCB Footprint: R0402; Value: 47K 1%; Part Type: 贴片电阻; CHIPS_PART_NAME: R; CDS_SEC: 1
R171 = R: SMD  0402  47K  1/16W  ±1%  ROHS; Part Reference: R171; Part Number: A1R01.00248; CDS_PART_NAME: R_0402-47K,5 %,62.5MW,195-0599-000; CDS_PHYS_PART_NAME: R_0402-47K,5 %,62.5MW,195-0599-000-195-0599-000,47K; ASSEMBLY: M2_WIFIBT; CDS_LIB: discrete; CDS_SEC: 1; DEVICE_TYPENAME: R_0402-47K5625MW195-0599-000-195-0599-00047K; DRAWING: #NAME?; MAX_WATTAGE: 62.5mW; NV_PN: 195-0599-000; PACK_TYPE: 402; PATH: I43; PHYS_PAGE: 20; ROT: 0; SIGNAL_MODEL: nv_res; TOL: 5%; VER: 2; XY: (-7200,2950); PCB Footprint: R0402; Value: 47K 1%; Part Type: 贴片电阻; CHIPS_PART_NAME: R; SEC: 1
R172 = R: SMD  0402  0R  1/16W  ±1%  ROHS; Part Reference: R172; Part Number: A1R01.00219; PCB Footprint: R0402; Value: NC/0R 1%; Part Type: 贴片电阻
R173 = R: SMD  0402  0R  1/16W  ±1%  ROHS; Part Reference: R173; Part Number: A1R01.00219; PCB Footprint: R0402; Value: NC/0R 1%; Part Type: 贴片电阻
R396 = R: SMD  0402  47K  1/16W  ±1%  ROHS; Part Reference: R396; Part Number: A1R01.00248; PCB Footprint: R0402; Value: 47K 1%; Part Type: 贴片电阻
*#20 = radxa_1010: Page Create Date: March  8, 1995; Page Size: =PageSize; Page Count: 21; Page Modify Date: =ModifiedDate

## Nets that join several sheets
3V3: 04_SODIMM connector 1_3 (5 pins), 05_SODIMM connector 2_3 (R19.1 R21.1), 06_SODIMM connector 3_3 (R28.1), 07_DC Jack and DCDC (7 pins), 08_Fan Debug and EEPROM (R219.1 U42.1), 09_1V8 LDO & 3V3 AO Rails (C23.1 U11.1), 10_TYPE_C (6 pins), 11_USB3.1 x4 HUB (C422.1 U113.3), 15_Gigabit_Ethernet (C91.2 J9.15 J9.17), 16_HDMI&DP (U30.5 U108.5), 17_CAM_Connector (10 pins), 18_40Pin_GPIO_expansion_heade (9 pins), 21_KEY_E (10 pins)
3V3_AO: 07_DC Jack and DCDC (R41.1 R44.1 R49.1 R129.1), 09_1V8 LDO & 3V3 AO Rails (6 pins), 14_BUTTON_MCU (10 pins)
HUB2_SSTX_N_J25: 04_SODIMM connector 1_3 (80 pins), 06_SODIMM connector 3_3 (U5.3), 07_DC Jack and DCDC (72 pins), 08_Fan Debug and EEPROM (31 pins), 09_1V8 LDO & 3V3 AO Rails (10 pins), 10_TYPE_C (25 pins), 11_USB3.1 x4 HUB (31 pins), 12_USB3.1 Type-A x2 (A) (27 pins), 13_USB3.1 Type-A x2 (B) (17 pins), 14_BUTTON_MCU (23 pins), 15_Gigabit_Ethernet (C91.1 C93.1 J9.19 J9.20), 16_HDMI&DP (49 pins), 17_CAM_Connector (56 pins), 18_40Pin_GPIO_expansion_heade (23 pins), 19_KEY_M_X4 (24 pins), 20_KEY_M_X2 (22 pins), 21_KEY_E (21 pins)
MKEY_3V3: 07_DC Jack and DCDC (7 pins), 19_KEY_M_X4 (16 pins), 20_KEY_M_X2 (16 pins)
OUT: 12_USB3.1 Type-A x2 (A) (U25.1), 13_USB3.1 Type-A x2 (B) (U17.1)
PC_LED+: 04_SODIMM connector 1_3 (D30.1 R10.1), 07_DC Jack and DCDC (11 pins), 08_Fan Debug and EEPROM (C150.1 FB3.1 J21.2 U24.1), 09_1V8 LDO & 3V3 AO Rails (C27.1 C28.1 R57.1 U12.3), 10_TYPE_C (C75.1 U7.5), 11_USB3.1 x4 HUB (C403.2 R345.2 U114.5), 12_USB3.1 Type-A x2 (A) (C74.1 U25.5), 13_USB3.1 Type-A x2 (B) (C81.1 U17.5), 16_HDMI&DP (C121.1 C122.1 U109.5), 18_40Pin_GPIO_expansion_heade (C80.1 C158.1 J2.2 J2.4)
VCC: 14_BUTTON_MCU (U20.5 U22.5), 17_CAM_Connector (U15.5 U16.5)
VDD_1V8: 04_SODIMM connector 1_3 (R3.1 R4.1), 06_SODIMM connector 3_3 (U5.5), 08_Fan Debug and EEPROM (12 pins), 09_1V8 LDO & 3V3 AO Rails (C24.1 U11.5), 16_HDMI&DP (C50.1 R26.1 U1.9), 18_40Pin_GPIO_expansion_heade (R200.1 U37.20 U38.20 U39.20), 19_KEY_M_X4 (R62.1 R63.1 R64.1), 21_KEY_E (R69.1 R70.1)
VDD_CVM: 04_SODIMM connector 1_3 (12 pins), 07_DC Jack and DCDC (C51.1 C65.1 Q10.5 Q20.5), 14_BUTTON_MCU (R114.1)
VDD_DCIN: 07_DC Jack and DCDC (7 pins), 14_BUTTON_MCU (Q16.2 R116.2)
AP_WAKE_BT: 20_KEY_M_X2 (R169.1), 21_KEY_E (Q29.1)
AUTO_ON_DIS: 04_SODIMM connector 1_3 (D4.2 J1.240 R10.2), 08_Fan Debug and EEPROM (J21.6 J21.12 R220.1), 14_BUTTON_MCU (D33.3)
BMCU_ACOK: 08_Fan Debug and EEPROM (D64.2 J21.5), 14_BUTTON_MCU (C88.1 R100.2 R101.1 U21.16)
BT_M2_EN: 05_SODIMM connector 2_3 (J1.126), 21_KEY_E (Q12.1)
BT_M2_WAKE_AP: 05_SODIMM connector 2_3 (J1.124), 21_KEY_E (J15.20 R396.2)
BUCK_3V3_EN: 07_DC Jack and DCDC (5 pins), 11_USB3.1 x4 HUB (R343.2 U114.4), 14_BUTTON_MCU (U21.13 U22.4)
BUCK_3V3_PG: 07_DC Jack and DCDC (R54.2 U3.7), 09_1V8 LDO & 3V3 AO Rails (U11.3), 14_BUTTON_MCU (R113.2), 16_HDMI&DP (R131.1)
BUCK_5V_PG: 07_DC Jack and DCDC (R81.2 U4.4), 09_1V8 LDO & 3V3 AO Rails (R57.2 U12.4), 14_BUTTON_MCU (Q5.1 R121.1 U19.2)
CAM0_MCLK: 05_SODIMM connector 2_3 (J1.116), 17_CAM_Connector (D27.1 U13.18)
CAM0_PWDN: 05_SODIMM connector 2_3 (J1.114), 17_CAM_Connector (U15.2)
CAM1_MCLK: 05_SODIMM connector 2_3 (J1.122), 17_CAM_Connector (D19.1 U14.18)
CAM1_PWDN: 05_SODIMM connector 2_3 (J1.120), 17_CAM_Connector (U16.2)
CAM_I2C_SCL: 05_SODIMM connector 2_3 (J1.213 R21.2), 17_CAM_Connector (U31.1)
CAM_I2C_SDA: 05_SODIMM connector 2_3 (J1.215 R19.2), 17_CAM_Connector (U31.2)
CAM_MUX_SEL: 05_SODIMM connector 2_3 (J1.130), 17_CAM_Connector (R151.1 U31.10)
CSI0_D0_N: 05_SODIMM connector 2_3 (J1.4), 17_CAM_Connector (D22.1 U13.11)
CSI0_D0_P: 05_SODIMM connector 2_3 (J1.6), 17_CAM_Connector (D23.1 U13.12)
CSI0_D1_N: 05_SODIMM connector 2_3 (J1.16), 17_CAM_Connector (D24.1 U13.14)
CSI0_D1_P: 05_SODIMM connector 2_3 (J1.18), 17_CAM_Connector (D25.1 U13.15)
CSI1_CLK_N: 05_SODIMM connector 2_3 (J1.9), 17_CAM_Connector (D51.1 U13.8)
CSI1_CLK_P: 05_SODIMM connector 2_3 (J1.11), 17_CAM_Connector (D52.1 U13.9)
CSI1_D0_N: 05_SODIMM connector 2_3 (J1.3), 17_CAM_Connector (D47.1 U13.2)
CSI1_D0_P: 05_SODIMM connector 2_3 (J1.5), 17_CAM_Connector (D48.1 U13.3)
CSI1_D1_N: 05_SODIMM connector 2_3 (J1.15), 17_CAM_Connector (D49.1 U13.5)
CSI1_D1_P: 05_SODIMM connector 2_3 (J1.17), 17_CAM_Connector (D50.1 U13.6)
CSI2_CLK_N: 05_SODIMM connector 2_3 (J1.28), 17_CAM_Connector (D10.1 U14.8)
CSI2_CLK_P: 05_SODIMM connector 2_3 (J1.30), 17_CAM_Connector (D13.1 U14.9)
CSI2_D0_N: 05_SODIMM connector 2_3 (J1.22), 17_CAM_Connector (D6.1 U14.2)
CSI2_D0_P: 05_SODIMM connector 2_3 (J1.24), 17_CAM_Connector (D7.1 U14.3)
CSI2_D1_N: 05_SODIMM connector 2_3 (J1.34), 17_CAM_Connector (D8.1 U14.5)
CSI2_D1_P: 05_SODIMM connector 2_3 (J1.36), 17_CAM_Connector (D9.1 U14.6)
CSI3_D0_N: 05_SODIMM connector 2_3 (J1.21), 17_CAM_Connector (D14.1 U14.11)
CSI3_D0_P: 05_SODIMM connector 2_3 (J1.23), 17_CAM_Connector (D15.1 U14.12)
CSI3_D1_N: 05_SODIMM connector 2_3 (J1.33), 17_CAM_Connector (D16.1 U14.14)
CSI3_D1_P: 05_SODIMM connector 2_3 (J1.35), 17_CAM_Connector (D17.1 U14.15)
FAN_PWM: 05_SODIMM connector 2_3 (J1.230), 08_Fan Debug and EEPROM (R241.2 U24.4)
FAN_TACH: 05_SODIMM connector 2_3 (J1.208), 08_Fan Debug and EEPROM (Q14.2 R218.2)
FORCE_RECOVERY*: 04_SODIMM connector 1_3 (D3.2 J1.214), 08_Fan Debug and EEPROM (J21.10)
GBE_LED_ACT: 05_SODIMM connector 2_3 (J1.194), 15_Gigabit_Ethernet (R122.1)
GBE_LED_LINK: 05_SODIMM connector 2_3 (J1.188), 15_Gigabit_Ethernet (R80.1)
GBE_MDI0_N: 05_SODIMM connector 2_3 (J1.184), 15_Gigabit_Ethernet (J9.2)
GBE_MDI0_P: 05_SODIMM connector 2_3 (J1.186), 15_Gigabit_Ethernet (J9.1)
GBE_MDI1_N: 05_SODIMM connector 2_3 (J1.190), 15_Gigabit_Ethernet (J9.6)
GBE_MDI1_P: 05_SODIMM connector 2_3 (J1.192), 15_Gigabit_Ethernet (J9.3)
GBE_MDI2_N: 05_SODIMM connector 2_3 (J1.196), 15_Gigabit_Ethernet (J9.8)
GBE_MDI2_P: 05_SODIMM connector 2_3 (J1.198), 15_Gigabit_Ethernet (J9.7)
GBE_MDI3_N: 05_SODIMM connector 2_3 (J1.202), 15_Gigabit_Ethernet (J9.10)
GBE_MDI3_P: 05_SODIMM connector 2_3 (J1.204), 15_Gigabit_Ethernet (J9.9)
GPIO01: 05_SODIMM connector 2_3 (J1.118), 18_40Pin_GPIO_expansion_heade (U39.7)
GPIO07: 05_SODIMM connector 2_3 (J1.206), 18_40Pin_GPIO_expansion_heade (U37.5)
GPIO09: 05_SODIMM connector 2_3 (J1.211), 18_40Pin_GPIO_expansion_heade (U39.4)
GPIO11: 05_SODIMM connector 2_3 (J1.216), 18_40Pin_GPIO_expansion_heade (U39.6)
GPIO12: 05_SODIMM connector 2_3 (J1.218), 18_40Pin_GPIO_expansion_heade (U37.6)
GPIO13: 05_SODIMM connector 2_3 (J1.228), 18_40Pin_GPIO_expansion_heade (U39.5)
HDMI/DP/HPD: 06_SODIMM connector 3_3 (J1.96), 16_HDMI&DP (Q4.3 R25.1 R26.2)
HDMI_CEC: 06_SODIMM connector 3_3 (J1.94), 16_HDMI&DP (D99.1 Q6.2 R127.1)
HDMI_DDC_SCL_POL: 06_SODIMM connector 3_3 (J1.100), 16_HDMI&DP (U1.7)
HDMI_DDC_SDA_POL: 06_SODIMM connector 3_3 (J1.98), 16_HDMI&DP (U1.8)
HUB1_DM: 11_USB3.1 x4 HUB (U28.8), 12_USB3.1 Type-A x2 (A) (L5.3 R350.1)
HUB1_DP: 11_USB3.1 x4 HUB (U28.7), 12_USB3.1 Type-A x2 (A) (L5.4 R351.1)
HUB1_PWR_EN: 11_USB3.1 x4 HUB (U28.26), 12_USB3.1 Type-A x2 (A) (R90.1 U25.4)
HUB1_SSRX_N: 11_USB3.1 x4 HUB (U28.5), 12_USB3.1 Type-A x2 (A) (L22.4 R346.1)
HUB1_SSRX_P: 11_USB3.1 x4 HUB (U28.4), 12_USB3.1 Type-A x2 (A) (L22.3 R348.1)
HUB1_SSTX_N: 11_USB3.1 x4 HUB (C40.2), 12_USB3.1 Type-A x2 (A) (L23.4 R347.1)
HUB1_SSTX_P: 11_USB3.1 x4 HUB (C39.2), 12_USB3.1 Type-A x2 (A) (L23.3 R349.1)
HUB2_DM: 11_USB3.1 x4 HUB (U28.75), 12_USB3.1 Type-A x2 (A) (L6.3 R356.1)
HUB2_DP: 11_USB3.1 x4 HUB (U28.74), 12_USB3.1 Type-A x2 (A) (L6.4 R357.1)
HUB2_PWR_EN: 11_USB3.1 x4 HUB (U28.42), 13_USB3.1 Type-A x2 (B) (R95.1 U17.4)
HUB2_SSRX_N: 11_USB3.1 x4 HUB (U28.72), 12_USB3.1 Type-A x2 (A) (L20.4 R352.1)
HUB2_SSRX_P: 11_USB3.1 x4 HUB (U28.71), 12_USB3.1 Type-A x2 (A) (L20.3 R354.1)
HUB2_SSTX_N: 11_USB3.1 x4 HUB (C42.2), 12_USB3.1 Type-A x2 (A) (L21.4 R353.1)
HUB2_SSTX_P: 11_USB3.1 x4 HUB (C41.2), 12_USB3.1 Type-A x2 (A) (L21.3 R355.1)
HUB3_DM: 11_USB3.1 x4 HUB (U28.66), 13_USB3.1 Type-A x2 (B) (L7.3 R96.1)
HUB3_DP: 11_USB3.1 x4 HUB (U28.65), 13_USB3.1 Type-A x2 (B) (L7.4 R97.1)
HUB3_SSRX_N: 11_USB3.1 x4 HUB (U28.63), 13_USB3.1 Type-A x2 (B) (L24.4 R248.1)
HUB3_SSRX_P: 11_USB3.1 x4 HUB (U28.62), 13_USB3.1 Type-A x2 (B) (L24.3 R250.1)
HUB3_SSTX_N: 11_USB3.1 x4 HUB (C47.2), 13_USB3.1 Type-A x2 (B) (L25.4 R249.1)
HUB3_SSTX_P: 11_USB3.1 x4 HUB (C46.2), 13_USB3.1 Type-A x2 (B) (L25.3 R251.1)
HUB4_DM: 11_USB3.1 x4 HUB (U28.17), 13_USB3.1 Type-A x2 (B) (L8.3 R98.1)
HUB4_DP: 11_USB3.1 x4 HUB (U28.16), 13_USB3.1 Type-A x2 (B) (L8.4 R99.1)
HUB4_SSRX_N: 11_USB3.1 x4 HUB (U28.14), 13_USB3.1 Type-A x2 (B) (L26.4 R252.1)
HUB4_SSRX_P: 11_USB3.1 x4 HUB (U28.13), 13_USB3.1 Type-A x2 (B) (L26.3 R254.1)
HUB4_SSTX_N: 11_USB3.1 x4 HUB (C49.2), 13_USB3.1 Type-A x2 (B) (L27.4 R253.1)
HUB4_SSTX_P: 11_USB3.1 x4 HUB (C48.2), 13_USB3.1 Type-A x2 (B) (L27.3 R255.1)
I2C1_SCL: 04_SODIMM connector 1_3 (J1.189 R5.2), 18_40Pin_GPIO_expansion_heade (D62.2 J2.5)
I2C1_SDA: 04_SODIMM connector 1_3 (J1.191 R6.2), 18_40Pin_GPIO_expansion_heade (D63.2 J2.3)
I2C2_SCL: 04_SODIMM connector 1_3 (J1.232 R4.2), 08_Fan Debug and EEPROM (TP34.1 U41.6), 19_KEY_M_X4 (R158.1), 20_KEY_M_X2 (R94.1), 21_KEY_E (R172.1)
I2C2_SDA: 04_SODIMM connector 1_3 (J1.234 R3.2), 08_Fan Debug and EEPROM (TP35.1 U41.5), 19_KEY_M_X4 (R159.1), 20_KEY_M_X2 (R93.1), 21_KEY_E (R173.1)
I2S0_LRCK: 05_SODIMM connector 2_3 (J1.197), 18_40Pin_GPIO_expansion_heade (U39.3)
I2S0_SCLK: 05_SODIMM connector 2_3 (J1.199), 18_40Pin_GPIO_expansion_heade (U39.19)
I2S0_SDIN: 05_SODIMM connector 2_3 (J1.195), 18_40Pin_GPIO_expansion_heade (U39.2)
I2S0_SDOUT: 05_SODIMM connector 2_3 (J1.193), 18_40Pin_GPIO_expansion_heade (U39.1)
I2S1_LRCK: 05_SODIMM connector 2_3 (J1.224), 21_KEY_E (J15.10)
I2S1_SCLK: 05_SODIMM connector 2_3 (J1.226), 21_KEY_E (J15.8)
I2S1_SDIN: 05_SODIMM connector 2_3 (J1.222), 21_KEY_E (J15.12)
I2S1_SDOUT: 05_SODIMM connector 2_3 (J1.220), 21_KEY_E (J15.14)
ID_I2C_SCL: 04_SODIMM connector 1_3 (J1.185 R1.2), 10_TYPE_C (R86.1), 18_40Pin_GPIO_expansion_heade (D60.2 J2.28)
ID_I2C_SDA: 04_SODIMM connector 1_3 (J1.187 R2.2), 10_TYPE_C (R88.1), 18_40Pin_GPIO_expansion_heade (D61.2 J2.27)
M2_ALERT*: 05_SODIMM connector 2_3 (J1.212), 19_KEY_M_X4 (Q27.3 R64.2)
M2E_ALERT*: 19_KEY_M_X4 (R66.2), 21_KEY_E (J15.62)
M2E_SUSCLK_32KHZ: 06_SODIMM connector 3_3 (R28.2 U5.4), 21_KEY_E (J15.50)
M2M0_ALERT*: 19_KEY_M_X4 (R65.2), 20_KEY_M_X2 (J5.44)
M2M_SUSCLK_32KHZ: 19_KEY_M_X4 (J14.68 R61.2), 20_KEY_M_X2 (J5.68 R68.2)
MOD_SLEEP: 04_SODIMM connector 1_3 (J1.178 R14.1), 08_Fan Debug and EEPROM (R226.1), 16_HDMI&DP (R133.1 U108.4)
MODULE_ID: 04_SODIMM connector 1_3 (J1.217), 07_DC Jack and DCDC (Q25.1 R42.1 R43.2 R44.2)
PCIE0_CLK_N: 06_SODIMM connector 3_3 (J1.160), 19_KEY_M_X4 (C136.1 J14.53)
PCIE0_CLK_P: 06_SODIMM connector 3_3 (J1.162), 19_KEY_M_X4 (J14.55)
PCIE0_CLKREQ: 06_SODIMM connector 3_3 (J1.180), 19_KEY_M_X4 (J14.52)
PCIE0_RST: 06_SODIMM connector 3_3 (J1.181), 19_KEY_M_X4 (J14.50 R156.2)
PCIE0_RX0_N: 06_SODIMM connector 3_3 (J1.131), 19_KEY_M_X4 (C139.1 J14.41)
PCIE0_RX0_P: 06_SODIMM connector 3_3 (J1.133), 19_KEY_M_X4 (C138.1 J14.43)
PCIE0_RX1_N: 06_SODIMM connector 3_3 (J1.137), 19_KEY_M_X4 (C142.1 J14.29)
PCIE0_RX1_P: 06_SODIMM connector 3_3 (J1.139), 19_KEY_M_X4 (J14.31)
PCIE0_RX2_N: 06_SODIMM connector 3_3 (J1.149), 19_KEY_M_X4 (C143.1 J14.17)
PCIE0_RX2_P: 06_SODIMM connector 3_3 (J1.151), 19_KEY_M_X4 (C144.1 J14.19)
PCIE0_RX3_N: 06_SODIMM connector 3_3 (J1.155), 19_KEY_M_X4 (J14.5)
PCIE0_RX3_P: 06_SODIMM connector 3_3 (J1.157), 19_KEY_M_X4 (J14.7)
PCIE1_CLK_N: 06_SODIMM connector 3_3 (J1.173), 21_KEY_E (J15.49)
PCIE1_CLK_P: 06_SODIMM connector 3_3 (J1.175), 21_KEY_E (J15.47)
PCIE1_CLKREQ: 06_SODIMM connector 3_3 (J1.182), 21_KEY_E (J15.53 R161.2)
PCIE1_RST: 06_SODIMM connector 3_3 (J1.183), 21_KEY_E (J15.52 R163.2)
PCIE1_RX0_N: 06_SODIMM connector 3_3 (J1.167), 21_KEY_E (J15.43)
PCIE1_RX0_P: 06_SODIMM connector 3_3 (J1.169), 21_KEY_E (J15.41)
PCIE1_TX0_N: 06_SODIMM connector 3_3 (J1.172), 21_KEY_E (C130.2)
PCIE1_TX0_P: 06_SODIMM connector 3_3 (J1.174), 21_KEY_E (C131.2)
PCIE2_CLK_N: 05_SODIMM connector 2_3 (J1.52), 20_KEY_M_X2 (R154.2)
PCIE2_CLK_P: 05_SODIMM connector 2_3 (J1.54), 20_KEY_M_X2 (R146.2)
PCIE2_CLKREQ: 05_SODIMM connector 2_3 (J1.221), 20_KEY_M_X2 (R167.1)
PCIE2_RST: 05_SODIMM connector 2_3 (J1.219), 20_KEY_M_X2 (R71.2 R168.1)
PCIE2_RX0_N: 05_SODIMM connector 2_3 (J1.40), 20_KEY_M_X2 (R157.2)
PCIE2_RX0_P: 05_SODIMM connector 2_3 (J1.42), 20_KEY_M_X2 (R155.2)
PCIE2_RX1_N: 05_SODIMM connector 2_3 (J1.58), 20_KEY_M_X2 (R137.2 R141.2)
PCIE2_RX1_P: 05_SODIMM connector 2_3 (J1.60), 20_KEY_M_X2 (R136.2 R140.2)
PCIE2_TX1_N: 05_SODIMM connector 2_3 (J1.64), 20_KEY_M_X2 (R164.2)
PCIE2_TX1_P: 05_SODIMM connector 2_3 (J1.66), 20_KEY_M_X2 (R160.2)
PCIE3_CLK_N: 05_SODIMM connector 2_3 (J1.227), 20_KEY_M_X2 (R145.2)
PCIE3_CLK_P: 05_SODIMM connector 2_3 (J1.229), 20_KEY_M_X2 (R144.2)
PCIE3_CLKREQ: 05_SODIMM connector 2_3 (J1.225), 20_KEY_M_X2 (R165.1 R169.2)
PCIE3_RST: 05_SODIMM connector 2_3 (J1.223), 20_KEY_M_X2 (R166.1)
PCIE_WAKE: 06_SODIMM connector 3_3 (J1.179), 19_KEY_M_X4 (J14.54), 20_KEY_M_X2 (J5.54), 21_KEY_E (J15.55 R162.2)
POWER_EN: 04_SODIMM connector 1_3 (J1.237), 14_BUTTON_MCU (R110.1 U20.4)
PWR_LED_CTRL: 04_SODIMM connector 1_3 (R13.1), 05_SODIMM connector 2_3 (J1.127), 08_Fan Debug and EEPROM (R225.1)
SHUTDOWN_REQ*: 04_SODIMM connector 1_3 (J1.233), 14_BUTTON_MCU (D34.3 R114.2)
SPI0_CS0: 05_SODIMM connector 2_3 (J1.95), 18_40Pin_GPIO_expansion_heade (U37.3)
SPI0_CS1: 05_SODIMM connector 2_3 (J1.97), 18_40Pin_GPIO_expansion_heade (U37.4)
SPI0_MISO: 05_SODIMM connector 2_3 (J1.93), 18_40Pin_GPIO_expansion_heade (U37.1)
SPI0_MOSI: 05_SODIMM connector 2_3 (J1.89), 18_40Pin_GPIO_expansion_heade (U37.2)
SPI0_SCK: 05_SODIMM connector 2_3 (J1.91), 18_40Pin_GPIO_expansion_heade (U37.19)
SPI1_CS0: 05_SODIMM connector 2_3 (J1.110), 18_40Pin_GPIO_expansion_heade (U38.3)
SPI1_CS1: 05_SODIMM connector 2_3 (J1.112), 18_40Pin_GPIO_expansion_heade (U38.4)
SPI1_MISO: 05_SODIMM connector 2_3 (J1.108), 18_40Pin_GPIO_expansion_heade (U38.1)
SPI1_MOSI: 05_SODIMM connector 2_3 (J1.104), 18_40Pin_GPIO_expansion_heade (U38.2)
SPI1_SCK: 05_SODIMM connector 2_3 (J1.106), 18_40Pin_GPIO_expansion_heade (U38.19)
SYS_RST*: 04_SODIMM connector 1_3 (D2.2 J1.239), 08_Fan Debug and EEPROM (C164.1 J21.8), 14_BUTTON_MCU (R119.1 U22.2)
TN1_V+: 07_DC Jack and DCDC (J8.1), 15_Gigabit_Ethernet (J9.11)
TN2_V+: 07_DC Jack and DCDC (J8.2), 15_Gigabit_Ethernet (J9.12)
TN3_V+: 07_DC Jack and DCDC (J8.3), 15_Gigabit_Ethernet (J9.13)
TN4_V+: 07_DC Jack and DCDC (J8.4), 15_Gigabit_Ethernet (J9.14)
UART0_CTS: 04_SODIMM connector 1_3 (J1.105), 21_KEY_E (J15.34)
UART0_RTS: 04_SODIMM connector 1_3 (J1.103), 21_KEY_E (J15.36)
UART0_RXD: 04_SODIMM connector 1_3 (J1.101), 21_KEY_E (J15.22)
UART0_TXD: 04_SODIMM connector 1_3 (J1.99), 21_KEY_E (J15.32)
UART1_CTS: 04_SODIMM connector 1_3 (J1.209), 18_40Pin_GPIO_expansion_heade (U38.7)
UART1_RTS: 04_SODIMM connector 1_3 (J1.207), 18_40Pin_GPIO_expansion_heade (U37.7)
UART1_RXD: 04_SODIMM connector 1_3 (J1.205), 18_40Pin_GPIO_expansion_heade (U38.6)
UART1_TXD: 04_SODIMM connector 1_3 (J1.203), 18_40Pin_GPIO_expansion_heade (U38.5)
UART2_RXD: 04_SODIMM connector 1_3 (J1.236), 08_Fan Debug and EEPROM (U42.7)
UART2_TXD: 04_SODIMM connector 1_3 (J1.238), 08_Fan Debug and EEPROM (U42.6)
USB0_AP_N: 05_SODIMM connector 2_3 (J1.109), 10_TYPE_C (L4.4)
USB0_AP_P: 05_SODIMM connector 2_3 (J1.111), 10_TYPE_C (L4.3)
USB0_VBUS_DET*: 05_SODIMM connector 2_3 (J1.87), 10_TYPE_C (R85.1 R126.2)
USB1_AP_N: 05_SODIMM connector 2_3 (J1.115), 11_USB3.1 x4 HUB (R321.2)
USB1_AP_P: 05_SODIMM connector 2_3 (J1.117), 11_USB3.1 x4 HUB (R322.2)
USB2_AP_N: 05_SODIMM connector 2_3 (J1.121), 21_KEY_E (J15.5)
USB2_AP_P: 05_SODIMM connector 2_3 (J1.123), 21_KEY_E (J15.3)
USBSS1_RX_N: 06_SODIMM connector 3_3 (J1.39), 10_TYPE_C (U10.3)
USBSS1_RX_P: 06_SODIMM connector 3_3 (J1.41), 10_TYPE_C (U10.2)
USBSS1_TX_N: 06_SODIMM connector 3_3 (J1.45), 10_TYPE_C (U10.7)
USBSS1_TX_P: 06_SODIMM connector 3_3 (J1.47), 10_TYPE_C (U10.6)
USBSS_TX6_HUB_N: 06_SODIMM connector 3_3 (J1.161), 11_USB3.1 x4 HUB (C371.2)
USBSS_TX6_HUB_P: 06_SODIMM connector 3_3 (J1.163), 11_USB3.1 x4 HUB (C373.2)
USBSS_TX6_N: 06_SODIMM connector 3_3 (J1.166), 11_USB3.1 x4 HUB (C375.2)
USBSS_TX6_P: 06_SODIMM connector 3_3 (J1.168), 11_USB3.1 x4 HUB (C377.2)
VIN_PWR_ON: 07_DC Jack and DCDC (Q22.1 Q24.1), 14_BUTTON_MCU (R45.1)
W_DISABLE1_CTRL: 05_SODIMM connector 2_3 (J1.128), 21_KEY_E (Q13.1)